# EAGLE design rapidshark-lipo-sensor-mk-2.0 (EAGLE 6.5.0)
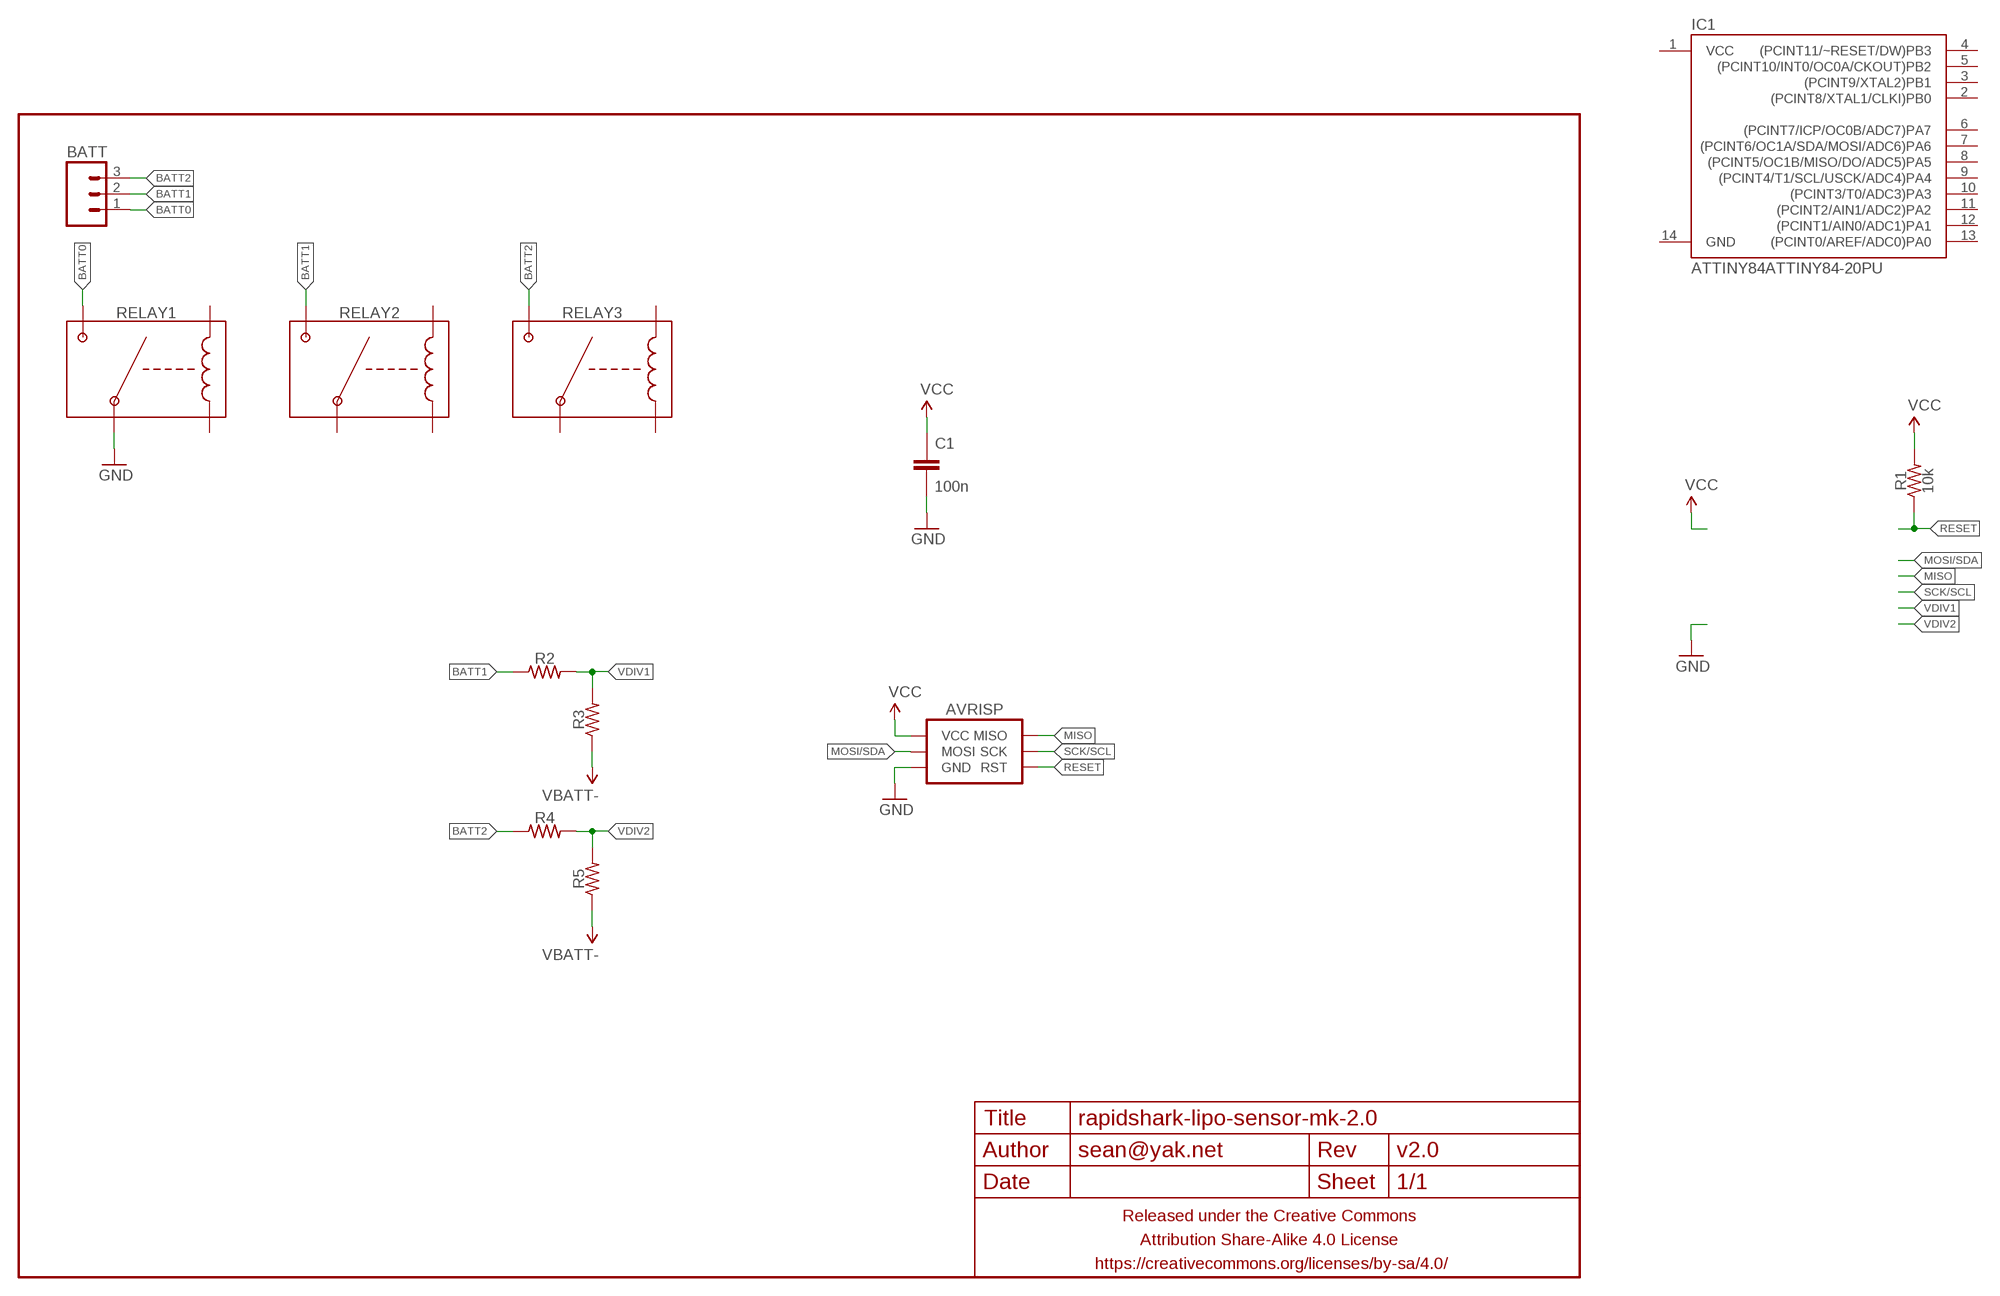
[diagram p0: schematic, sheet 1]

## Parts
AVRISP  AVR_SPI_PRG_6PTH_INLINE_I2C  [AVR_ISP_INLINE_PTH_I2C]
BATT  M03PTH-CENTERED  [1X03-CENTERED]
C1  100n  CAPACITOR-CERAMIC025-024X044  [C025-024X044]
FRAME1  FRAME-LETTERNO_PACKAGE  [DUMMY]
IC1  ATTINY84ATTINY84-20PU  [DIL14]
R1  10k  RESISTORPTH-AXIAL-7.62MM  [RESISTOR-AXIAL-PTH-7.62MM]
R2  RESISTORPTH-AXIAL-7.62MM  [RESISTOR-AXIAL-PTH-7.62MM]
R3  RESISTORPTH-AXIAL-7.62MM  [RESISTOR-AXIAL-PTH-7.62MM]
R4  RESISTORPTH-AXIAL-7.62MM  [RESISTOR-AXIAL-PTH-7.62MM]
R5  RESISTORPTH-AXIAL-7.62MM  [RESISTOR-AXIAL-PTH-7.62MM]
RELAY1  RELAY-SPST-NOCOTO-9007  [RELAY-SPST-NO-COTO-9007]
RELAY2  RELAY-SPST-NOCOTO-9007  [RELAY-SPST-NO-COTO-9007]
RELAY3  RELAY-SPST-NOCOTO-9007  [RELAY-SPST-NO-COTO-9007]

## Nets
BATT0: BATT.1 RELAY1.4(NO)
BATT1: BATT.2 R2.P$1 RELAY2.4(NO)
BATT2: BATT.3 R4.P$1 RELAY3.4(NO)
GND: AVRISP.GND C1.2 RELAY1.1(COM)
MISO: AVRISP.MISO
MOSI/SDA: AVRISP.MOSI
RESET: AVRISP.RESET(RST) R1.P$1
SCK/SCL: AVRISP.SCK
VBATT-: R3.P$1 R5.P$1
VCC: AVRISP.VCC C1.1 R1.P$2
VDIV1: R2.P$2 R3.P$2
VDIV2: R4.P$2 R5.P$2
Unconnected: IC1.1(VCC) IC1.2((PCINT8/XTAL1/CLKI)PB0) IC1.3((PCINT9/XTAL2)PB1) IC1.4((PCINT11/~RESET/DW)PB3) IC1.5((PCINT10/INT0/OC0A/CKOUT)PB2) IC1.6((PCINT7/ICP/OC0B/ADC7)PA7) IC1.7((PCINT6/OC1A/SDA/MOSI/ADC6)PA6) IC1.8((PCINT5/OC1B/MISO/DO/ADC5)PA5) IC1.9((PCINT4/T1/SCL/USCK/ADC4)PA4) IC1.10((PCINT3/T0/ADC3)PA3) IC1.11((PCINT2/AIN1/ADC2)PA2) IC1.12((PCINT1/AIN0/ADC1)PA1) IC1.13((PCINT0/AREF/ADC0)PA0) IC1.14(GND) RELAY1.2(C$1) RELAY1.3(C$2) RELAY2.1(COM) RELAY2.2(C$1) RELAY2.3(C$2) RELAY3.1(COM) RELAY3.2(C$1) RELAY3.3(C$2)

## Library data of the parts
AVRISP = A_butts:AVR_SPI_PRG_6: AVR ISP 6 Pin This is the reduced ISP connector for AVR programming. Common on Arduino. This footprint will take up less PCB space and can be used with a 10-pin to 6-pin adapter such as SKU: BOB-08508 **Special note about "TEST_POINT" package. The stop mask is on the top side, so if you want your programming test points to be on the bottom of your board, make sure to place this package on the bottom side of the board. This also ensure that the orientation to program from the bottom side will be correct.
BATT = A_butts:M03: Header 3 Standard 3-pin 0.1" header. Use with straight break away headers (SKU : PRT-00116), right angle break away headers (PRT-00553), swiss pins (PRT-00743), machine pins (PRT-00117), and female headers (PRT-00115). Molex polarized connector foot print use with SKU : PRT-08232 with associated crimp pins and housings.
C1 = A_butts:CAPACITOR-CERAMIC: CAPACITOR, European symbol
FRAME1 = A_butts:FRAME-LETTER: Schematic Frame Standard 8.5x11 US Letter frame; DESIGNER: sean@yak.net; VERSION: v2.0
IC1 = A_butts:ATTINY84: Atmel 14-pin 2/4/8kB flash uC
R1-R5 = A_butts:RESISTOR: RESISTOR, American symbol
RELAY1-RELAY3 = A_butts:RELAY-SPST-NO

## Board
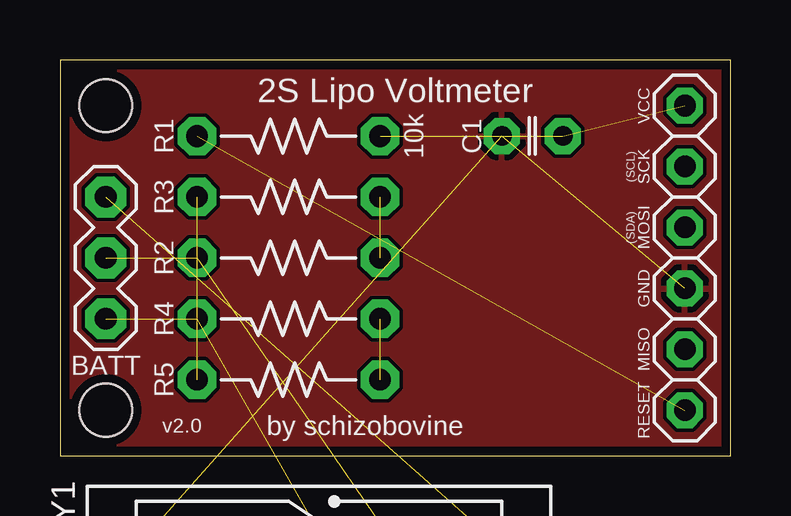
[diagram p1: board, top side]

Size 27.94 x 16.51 mm. Coordinates in mm from the lower left corner, seen from the top.
Outline: 0,16.51 0,0 27.94,0 27.94,16.51 0,16.51
Copper layers (1*16): Top 0.0356mm / dielectric 1.5011mm / Bottom 0.0356mm
Design rules "LaenPCBOrder_2": minimum track width 6mil, minimum drill 13mil, track to track 6mil, track to pad 6mil, pad to pad 6mil, via to via 6mil, smd to smd 6mil, copper to edge 15mil, drill to drill 6mil, minimum pad ring 7mil, minimum via ring 7mil, stop-mask expansion 3mil, vias tented up to drill 20mil, thermal gap 10mil
Holes 2.2 mm at 1.91,14.61 1.91,1.91

### Footprints (pad centres in the part's own frame; a part is rotated, then mirrored left to right if it is on the bottom)
AVR_ISP_INLINE_PTH_I2C = drill 0.9 pad 1.5 octagon: GND 1.27,0; MISO 3.81,0; MOSI -1.27,0; RESET 6.35,0; SCK -3.81,0; VCC -6.35,0
1X03-CENTERED = drill 0.9 pad 1.7 octagon: 1 -2.54,0; 2 0,0; 3 2.54,0
C025-024X044 = drill 0.813 pad 1.5 octagon: 1 -1.27,0; 2 1.27,0
DIL14 = drill 0.9 pad 1.5 octagon: 1 -7.62,-3.81; 2 -5.08,-3.81; 3 -2.54,-3.81; 4 0,-3.81; 5 2.54,-3.81; 6 5.08,-3.81; 7 7.62,-3.81; 8 7.62,3.81; 9 5.08,3.81; 10 2.54,3.81; 11 0,3.81; 12 -2.54,3.81; 13 -5.08,3.81; 14 -7.62,3.81
RESISTOR-AXIAL-PTH-7.62MM = drill 0.9 pad 1.6 octagon: P$1 -3.81,0; P$2 3.81,0
RELAY-SPST-NO-COTO-9007 = drill 0.9 pad 1.524: 1 -7.62,0; 2 -2.54,0; 3 2.54,0; 4 7.62,0

### Placement (x,y rotation side)
AVRISP  26.04,8.26 270 top
BATT  1.91,8.26 270 top
C1  19.68,13.34 180 top
FRAME1  0,0 0 top
IC1  8.89,-24.77 0 top  (outside the outline)
R1  9.53,13.34 0 top
R2  9.53,8.26 0 top
R3  9.53,10.79 0 top
R4  9.53,5.71 0 top
R5  9.53,3.17 0 top
RELAY1  10.79,-3.81 0 top  (outside the outline)
RELAY2  10.79,-10.16 0 top  (outside the outline)
RELAY3  10.79,-16.51 0 top  (outside the outline)

### Tracks (layer width: path | path; a pad name or v marks a point on that pad's centre or on a via)
BATT0  (1 unrouted)
BATT1  (2 unrouted)
BATT2  (2 unrouted)
GND  (2 unrouted)
  pour Top: 0,16.51 27.94,16.51 27.94,0 0,0
RESET  (1 unrouted)
VBATT-  (1 unrouted)
VCC  (2 unrouted)
VDIV1  (1 unrouted)
VDIV2  (1 unrouted)

### Text on the board
tPlace: 2S Lipo Voltmeter | by schizobovine